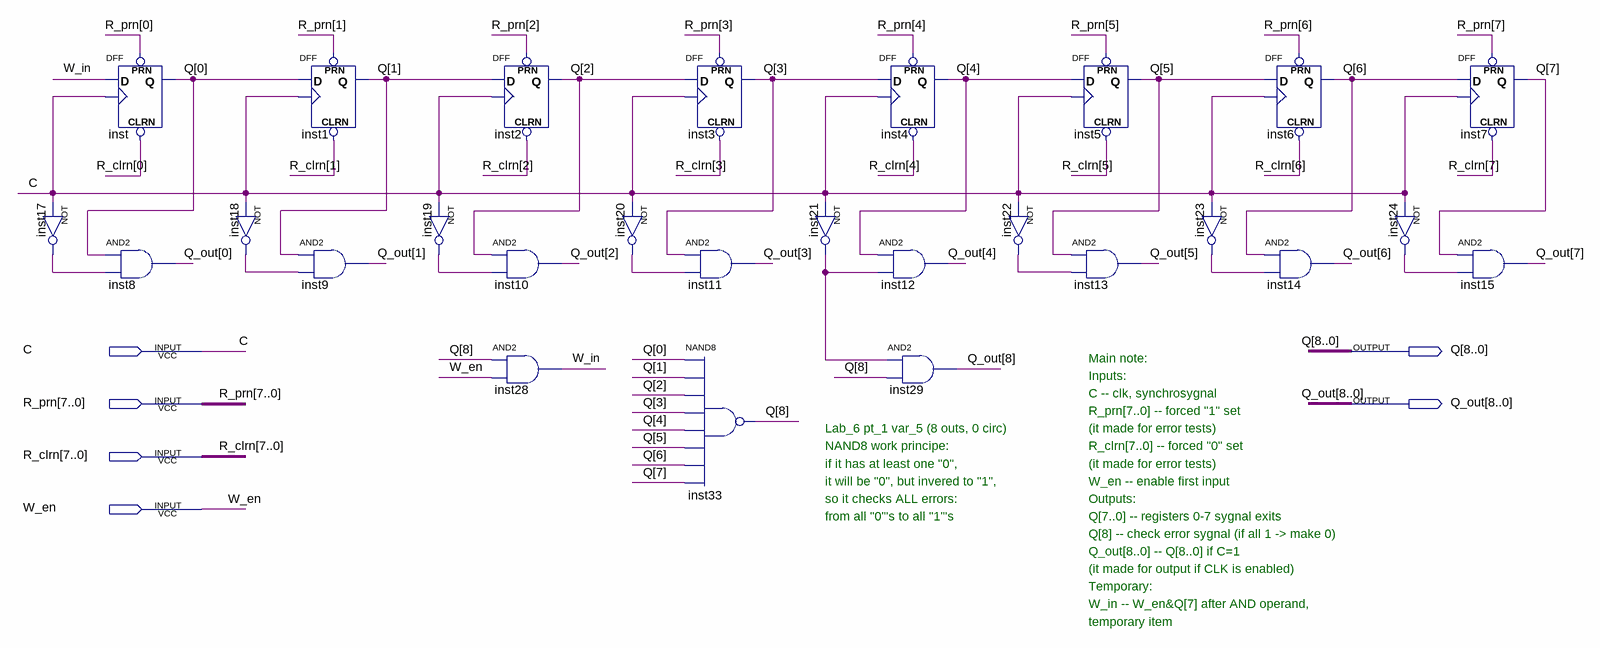
[diagram p0: schematic sheet]
// Quartus schematic Laboratory_work_6_1_circ0_OUR_project.bdf as structural Verilog: 27 symbols, 6 pins
module Laboratory_work_6_1_circ0_OUR_project (
  input  C,
  input  [7:0] R_prn,
  input  [7:0] R_clrn,
  input  W_en,
  output [8:0] Q,
  output [8:0] Q_out
);

  wire inst17_out, inst18_out, inst19_out, inst20_out, inst21_out, inst22_out, inst23_out, inst24_out, W_in;

  not inst17 (inst17_out, C);
  DFF inst (.CLRN(R_clrn[0]), .CLK(C), .D(W_in), .PRN(R_prn[0]), .Q(Q[0]));
  and inst8 (Q_out[0], Q[0], inst17_out);
  not inst18 (inst18_out, C);
  DFF inst1 (.CLRN(R_clrn[1]), .CLK(C), .D(Q[0]), .PRN(R_prn[1]), .Q(Q[1]));
  and inst9 (Q_out[1], Q[1], inst18_out);
  not inst19 (inst19_out, C);
  DFF inst2 (.CLRN(R_clrn[2]), .CLK(C), .D(Q[1]), .PRN(R_prn[2]), .Q(Q[2]));
  and inst10 (Q_out[2], Q[2], inst19_out);
  and inst28 (W_in, Q[8], W_en);
  not inst20 (inst20_out, C);
  DFF inst3 (.CLRN(R_clrn[3]), .CLK(C), .D(Q[2]), .PRN(R_prn[3]), .Q(Q[3]));
  and inst11 (Q_out[3], Q[3], inst20_out);
  nand inst33 (Q[8], Q[0], Q[1], Q[2], Q[3], Q[4], Q[5], Q[6], Q[7]);
  not inst21 (inst21_out, C);
  DFF inst4 (.CLRN(R_clrn[4]), .CLK(C), .D(Q[3]), .PRN(R_prn[4]), .Q(Q[4]));
  and inst12 (Q_out[4], Q[4], inst21_out);
  and inst29 (Q_out[8], inst21_out, Q[8]);
  not inst22 (inst22_out, C);
  DFF inst5 (.CLRN(R_clrn[5]), .CLK(C), .D(Q[4]), .PRN(R_prn[5]), .Q(Q[5]));
  and inst13 (Q_out[5], Q[5], inst22_out);
  not inst23 (inst23_out, C);
  DFF inst6 (.CLRN(R_clrn[6]), .CLK(C), .D(Q[5]), .PRN(R_prn[6]), .Q(Q[6]));
  and inst14 (Q_out[6], Q[6], inst23_out);
  not inst24 (inst24_out, C);
  DFF inst7 (.CLRN(R_clrn[7]), .CLK(C), .D(Q[6]), .PRN(R_prn[7]), .Q(Q[7]));
  and inst15 (Q_out[7], Q[7], inst24_out);

  // Notes on the sheet:
  //   Main note:
  //   Inputs:
  //   C -- clk, synchrosygnal
  //   R_prn[7..0] -- forced "1" set
  //   Lab_6 pt_1 var_5 (8 outs, 0 circ)
  //   (it made for error tests)
  //   NAND8 work principe:
  //   R_clrn[7..0] -- forced "0" set
  //   if it has at least one "0",
  //   (it made for error tests)
  //   it will be "0", but invered to "1",
  //   W_en -- enable first input
  //   so it checks ALL errors:
  //   Outputs:
  //   from all "0"'s to all "1"'s
  //   Q[7..0] -- registers 0-7 sygnal exits
  //   Q[8] -- check error sygnal (if all 1 -> make 0)
  //   Q_out[8..0] -- Q[8..0] if C=1
  //   (it made for output if CLK is enabled)
  //   Temporary:
  //   W_in -- W_en&Q[7] after AND operand,
  //   temporary item
endmodule
